# Altium schematic sheet TX1.SchDoc
size 431 x 279 mm; Organization: ORGANIZATION; Address1: ADDRESS 1; Address2: ADDRESS 2; Address3: ADDRESS 3; Address4: ADDRESS 4; Revision: -; SheetNumber: 3; SheetTotal: 8; ENG_APP_DATE: --/--/--; DSN_APP_DATE: --/--/--; CHK_APP_DATE: --/--/--
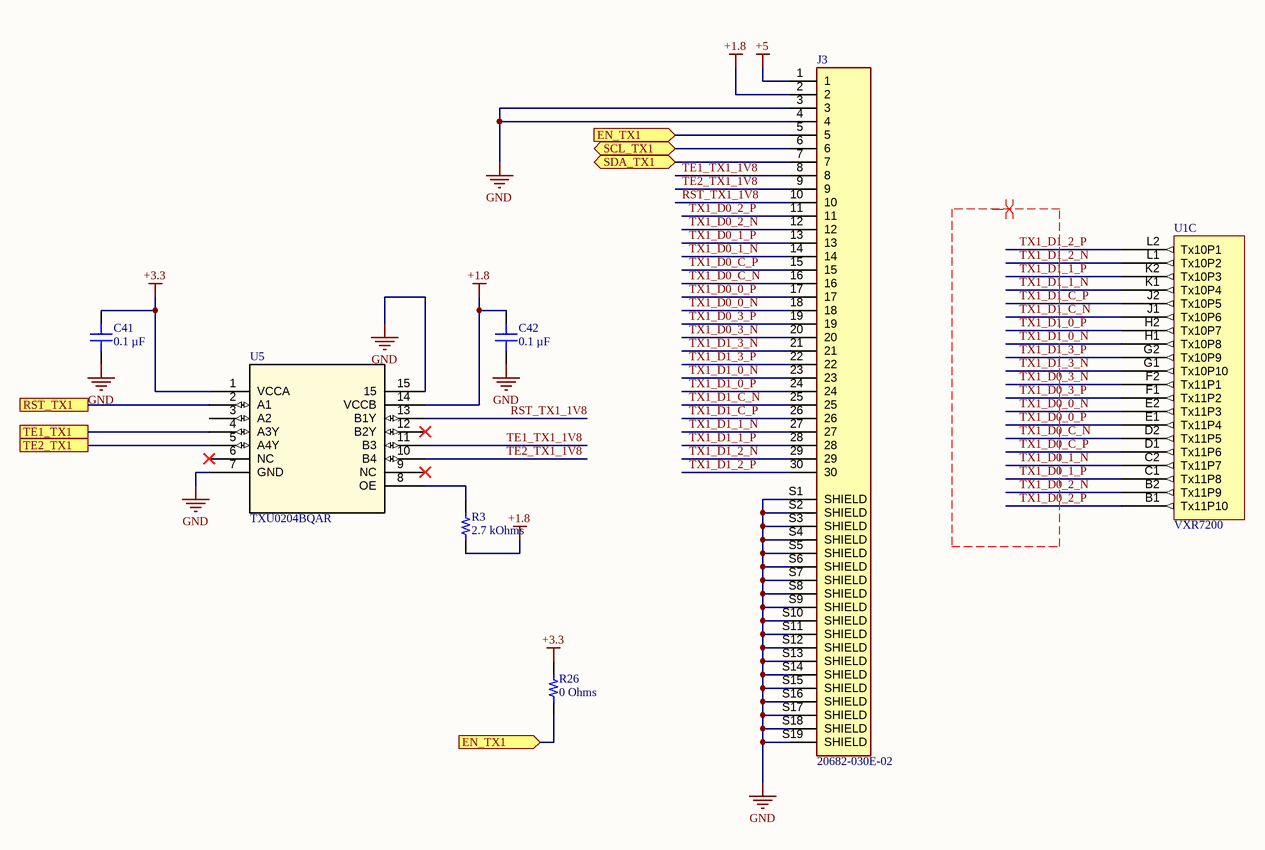
[diagram p0: TX1.SchDoc]

## Parts
C41  0.1 µF  [CAP 0201_0603]
C42  0.1 µF  [CAP 0201_0603]
J3  20682-030E-02  [IPEX_20682-030E-02]
R3  2.7 kOhms  [RES 0201_0603]
R26  0 Ohms  [RES 0402_1005]
U1  VXR7200  [BGA100P9X9-81A]  (part C of 9)
U5  TXU0204BQAR  [WQFN_04BQAR_TEX]

## Ports
EN_TX1 (in), RST_TX1, SCL_TX1 (bidir), SDA_TX1 (bidir), TE1_TX1, TE2_TX1

## Nets
+1.8: C42.2 J3.2 R3.1 U5.14(VCCB)
+3.3: C41.2 R26.2 U5.1(VCCA)
+5: J3.1
GND: C41.1 C42.1 J3.3 J3.4 J3.S1(SHIELD) J3.S2(SHIELD) J3.S3(SHIELD) J3.S4(SHIELD) J3.S5(SHIELD) J3.S6(SHIELD) J3.S7(SHIELD) J3.S8(SHIELD) J3.S9(SHIELD) J3.S10(SHIELD) J3.S11(SHIELD) J3.S12(SHIELD) J3.S13(SHIELD) J3.S14(SHIELD) J3.S15(SHIELD) J3.S16(SHIELD) J3.S17(SHIELD) J3.S18(SHIELD) J3.S19(SHIELD) U5.7(GND) U5.15
EN_TX1: J3.5 R26.1 ; port EN_TX1
RST_TX1: U5.2(A1) ; port RST_TX1
RST_TX1_1V8: J3.10 U5.13(B1Y)
SCL_TX1: J3.6 ; port SCL_TX1
SDA_TX1: J3.7 ; port SDA_TX1
TE1_TX1: U5.4(A3Y) ; port TE1_TX1
TE1_TX1_1V8: J3.8 U5.11(B3)
TE2_TX1: U5.5(A4Y) ; port TE2_TX1
TE2_TX1_1V8: J3.9 U5.10(B4)
TX1_D0_0_N: J3.18 U1.E2(Tx11P3)
TX1_D0_0_P: J3.17 U1.E1(Tx11P4)
TX1_D0_1_N: J3.14 U1.C2(Tx11P7)
TX1_D0_1_P: J3.13 U1.C1(Tx11P8)
TX1_D0_2_N: J3.12 U1.B2(Tx11P9)
TX1_D0_2_P: J3.11 U1.B1(Tx11P10)
TX1_D0_3_N: J3.20 U1.F2(Tx11P1)
TX1_D0_3_P: J3.19 U1.F1(Tx11P2)
TX1_D0_C_N: J3.16 U1.D2(Tx11P5)
TX1_D0_C_P: J3.15 U1.D1(Tx11P6)
TX1_D1_0_N: J3.23 U1.H1(Tx10P8)
TX1_D1_0_P: J3.24 U1.H2(Tx10P7)
TX1_D1_1_N: J3.27 U1.K1(Tx10P4)
TX1_D1_1_P: J3.28 U1.K2(Tx10P3)
TX1_D1_2_N: J3.29 U1.L1(Tx10P2)
TX1_D1_2_P: J3.30 U1.L2(Tx10P1)
TX1_D1_3_N: J3.21 U1.G1(Tx10P10)
TX1_D1_3_P: J3.22 U1.G2(Tx10P9)
TX1_D1_C_N: J3.25 U1.J1(Tx10P6)
TX1_D1_C_P: J3.26 U1.J2(Tx10P5)
NetR3_2: R3.2 U5.8(OE)

Not connected (* = marked no-connect by the designer): U5 3(A2) 6(NC)* 9(NC)* 12(B2Y)*

## Layout directives
differential pair; net class MIPI; differential pair class MIPI: TX1_D0_0_N, TX1_D0_0_P, TX1_D0_1_N, TX1_D0_1_P, TX1_D0_2_N, TX1_D0_2_P, TX1_D0_3_N, TX1_D0_3_P, TX1_D0_C_N, TX1_D0_C_P, TX1_D1_0_N, TX1_D1_0_P, TX1_D1_1_N, TX1_D1_1_P, TX1_D1_2_N, TX1_D1_2_P, TX1_D1_3_N, TX1_D1_3_P, TX1_D1_C_N, TX1_D1_C_P

## Notes on the sheet
- DWG. NO.
- REV.
- SHT.
- REVISION
- DESCRIPTION
- DATE
- APPROVED
- ENG:
- APPROVALS
- PROJECT
- DSN:
- CHK:
- REFERENCE DOCUMENTS
- PROJECT REVISION:
- TITLE
- SimulaVR
- DOCUMENT REVISION:
- DESIGN ITEM:
- BOM:
- FAB DWG:
- PCB DWG:
- ASSY DWG:
- SCALE:
- SIZE
- B
- CAGE CODE
- FILE NAME
- DWG NO.
- SHEET
- OF
- REV

## Library data of the parts
C41 C42 = GRM033R61E104KE14D: CAP CER 0.1UF 25V X5R 0201; manufacturer: Murata Electronics; Tolerance: ±10%; Part Number: GRM033R61E104KE14D; Value: 0.1 µF; Applications: General Purpose; Capacitance: 0.1 µF; componentlink1description: Datasheet; componentlink1url: https://search.murata.co.jp/Ceramy/image/img/A01X/G101/ENG/GRM033R61E104KE14-01.pdf; componentlink2description: DigiKey Link; componentlink2url: https://www.digikey.com/en/products/detail/murata-electronics/GRM033R61E104KE14D/4904731; Device Package: 0201 (0603 Metric); lastupdated: 5/20/2022 2:33:00 PM; Lifecycle Status: Active; Minimum Order: 1; Mounting Type: Surface Mount; Operating Temperature: -55°C ~ 85°C; Package / Case: 0201 (0603 Metric); packaging: TapeAndReel; partid: 39731; Part Status: Active; price: 0.01; series: GRM; Size / Dimension: 0.024" L x 0.012" W (0.60mm x 0.30mm); Supplier 1: DigiKey; Supplier Part Number 1: 490-12686-1-ND; Temperature Coefficient: X5R; Thickness (Max): 0.013" (0.33mm); Voltage - Rated: 25V
J3 = 20682-030E-02: Cabline-CAII Rece. Ass'y; MF: {'manufacturer': u'I-PEX'}; Value: *; Availability: Unavailable; Price: None; Package: None; MP: 20682-030E-02
R3 = ERJ-U01J272C: RES 2.7K OHM 5% 1/20W 0201 SMD; Manufacturer: Panasonic Electronic Components; Power (Watts): 0.05W, 1/20W; Temperature Coefficient: ±200ppm/°C; Part Number: ERJ-U01J272C; Value: 2.7 kOhms; ComponentLink1Description: Datasheet; ComponentLink1URL: https://industrial.panasonic.com/cdbs/www-data/pdf/RDP0000/AOA0000C334.pdf; ComponentLink2Description: DigiKey Link; ComponentLink2URL: https://www.digikey.com/en/products/detail/panasonic-electronic-components/ERJ-U01J272C/11641374; Composition: Thick Film; Device Package: 0201 (0603 Metric); Features: Anti-Sulfur; Height - Seated (Max): 0.010" (0.26mm); LastUpdated: 2022-04-12 22:15:26; Lifecycle Status: Active; Minimum Order: 1; Number of Terminations: 2; Operating Temperature: -55°C ~ 125°C; Package / Case: 0201 (0603 Metric); Packaging: TapeAndReel; PartId: 64645; Part Status: Active; Price: 0.04; Resistance: 2.7 kOhms; Series: ERJ-U01; Size / Dimension: 0.024" L x 0.012" W (0.60mm x 0.30mm); Supplier 1: DigiKey; Supplier Part Number 1: 10-ERJ-U01J272CCT-ND; Supplier Device Package: 0201; Tolerance: ±5%
R26 = AC0402FR-070RL: RESISTOR 0402 JUMPER ZERO OHM; Manufacturer: Yageo; Power (Watts): 0.063W, 1/16W; Part Number: AC0402FR-070RL; Value: 0 Ohms; ComponentLink1Description: Datasheet; ComponentLink1URL: https://www.yageo.com/upload/media/product/productsearch/datasheet/rchip/PYu-AC_51_RoHS_L_8.pdf; ComponentLink2Description: DigiKey Link; ComponentLink2URL: https://www.digikey.com/en/products/detail/yageo/AC0402FR-070RL/12082398; Composition: Thick Film; Device Package: 0402 (1005 Metric); Features: Automotive AEC-Q200, Moisture Resistant; Height - Seated (Max): 0.015" (0.37mm); LastUpdated: 2022-04-12 22:19:37; Lifecycle Status: Active; Minimum Order: 1; Number of Terminations: 2; Operating Temperature: -55°C ~ 155°C; Package / Case: 0402 (1005 Metric); Packaging: CutTape; PartId: 66976; Part Status: Active; Price: 0.01; Ratings: AEC-Q200; Resistance: 0 Ohms; Series: AC; Size / Dimension: 0.039" L x 0.020" W (1.00mm x 0.50mm); Supplier 1: DigiKey; Supplier Part Number 1: 13-AC0402FR-070RLCT-ND; Supplier Device Package: 0402; Tolerance: Jumper
U1 = CMP-015-00008-4: VXR7200 DP to MIPI-DSI bridge
U5 = CMP-006-000001-1: No Description Available; Mfr_Name: Texas Instruments; Design Item ID: TXU0204BQAR; RefDes: RefDes; Copyright: Copyright (C) 2022 Ultra Librarian. All rights reserved.; Type: DEV; Manufacturer_Part_Number: TXU0204BQAR; Source: TXU0204BQAR.SchLib